# Altium schematic sheet H_Bridge.SchDoc: Memristor HDrive
size A4; Author: Nikola Rašević; Organization: Memristor-Robotics; Address1: Vladimira Perića Valtera 2; Address2: 21000 Novi Sad; Address3: Serbia; SheetNumber: 10; SheetTotal: 11
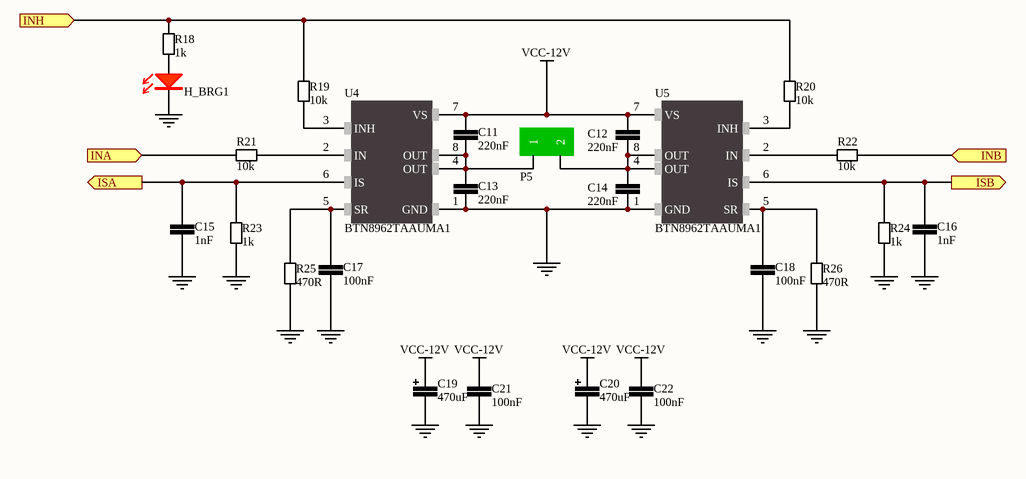
[diagram p0: H_Bridge.SchDoc]

## Parts
C11  220nF  [CER_0805]
C12  220nF  [CER_0805]
C13  220nF  [CER_0805]
C14  220nF  [CER_0805]
C15  1nF  [CER_0805]
C16  1nF  [CER_0805]
C17  100nF  [CER_0805]
C18  100nF  [CER_0805]
C19  470uF  [CAP10X20_RADIAL]
C20  470uF  [CAP10X20_RADIAL]
C21  100nF  [CER_0805]
C22  100nF  [CER_0805]
H_BRG1  LED RED  [LED_RED_0805]  (value not drawn)
P5  *  [MOTOR_CON]  (value not drawn)
R18  1k  [RESC2013X38N-0805-NOOVERLAY]
R19  10k  [RESC2013X38N-0805-NOOVERLAY]
R20  10k  [RESC2013X38N-0805-NOOVERLAY]
R21  10k  [RESC2013X38N-0805-NOOVERLAY]
R22  10k  [RESC2013X38N-0805-NOOVERLAY]
R23  1k  [RESC2013X38N-0805-NOOVERLAY]
R24  1k  [RESC2013X38N-0805-NOOVERLAY]
R25  470R  [RESC2013X38N-0805-NOOVERLAY]
R26  470R  [RESC2013X38N-0805-NOOVERLAY]
U4  BTN8962TAAUMA1  [TO263-7]
U5  BTN8962TAAUMA1  [TO263-7]

## Ports
INA (in), INB (in), INH (in), ISA (out), ISB (out)

## Nets
GND: C13.1 C14.1 C15.1 C16.1 C17.1 C18.1 C19.2 C20.2 C21.1 C22.1 H_BRG1.1(C) R23.1 R24.1 R25.1 R26.1 U4.1(GND) U5.1(GND)
VCC-12V: C11.2 C12.1 C19.1 C20.1 C21.2 C22.2 U4.7(VS) U5.7(VS)
INA: R21.2 ; port INA
INB: R22.2 ; port INB
INH: R18.2 R19.2 R20.2 ; port INH
ISA: C15.2 R23.2 U4.6(IS) ; port ISA
ISB: C16.2 R24.2 U5.6(IS) ; port ISB
NetC11_1: C11.1 C13.2 P5.1 U4.4(OUT) U4.8(OUT)
NetC12_2: C12.2 C14.2 P5.2 U5.4(OUT) U5.8(OUT)
NetC17_2: C17.2 R25.2 U4.5(SR)
NetC18_2: C18.2 R26.2 U5.5(SR)
NetH_BRG1_2: H_BRG1.2(A) R18.1
NetR19_1: R19.1 U4.3(INH)
NetR20_1: R20.1 U5.3(INH)
NetR21_1: R21.1 U4.2(IN)
NetR22_1: R22.1 U5.2(IN)

## Notes on the sheet
- Title
- Date:
- Design Engineer:
- Time:
- Revision:
- Sheet
- of
- Size:
- A4
- www.memristor-robotics.io
- File:

## Library data of the parts
C11-C14 = 00002205: CAP CER 220n 10V X5R 10% 0805; Capacitance: 220nF
C15 C16 = 00002105_1: CAP CER 1n 50V X7R 10% 0805; Capacitance: 1nF
C17 C18 C21 C22 = 00002105: CAP CER 100n 50V X7R 10% 0805; Capacitance: 100nF
C19 C20 = 00004707: CAP ALU 470u 25V 20%; Capacitance: 470uF
H_BRG1 = LED_RED_0805: LED RED 0805; Manufacturer: BRIGHT LED ELECTRONICS; Manufacturer Part Number: BL-HUB35A-AV-TRB; Barcode: 2911010024321; id: 35; Assembly: SMD; Voltage Forward: 2.0 V; item_id: 3341; Recommended Rating: Platinum; Package Case: 0805 (2012 Metric); Color: Red; Family: LED; Part Type: Optoelectronics
P5 = MOT_CONN: CONNECTOR FOR MOTOR OUTPUT; Manufacturer Part Number: *
R18 R23 R24 = 00001001: RES SMD 1 kOhm 1/8W 0805; Power: 0.125W, 1/8W; Barcode: 00009101; Resistance: 1k; Assembly: SMD
R19-R22 = 000001002: RES SMD 10 kOhm 1/8W 0805; Resistance: 10k
R25 R26 = 00004700: RES SMD 470 Ohm 1/8W 0805; Power: 0.125W, 1/8W; Barcode: 00006200; Resistance: 470R; Assembly: SMD
U4 U5 = 00000010: IC MOTOR DRIVER PAR TO263-7; Manufacturer Part Number: BTN8962TAAUMA1